# EAGLE design uDC_module (EAGLE 7.2.0)
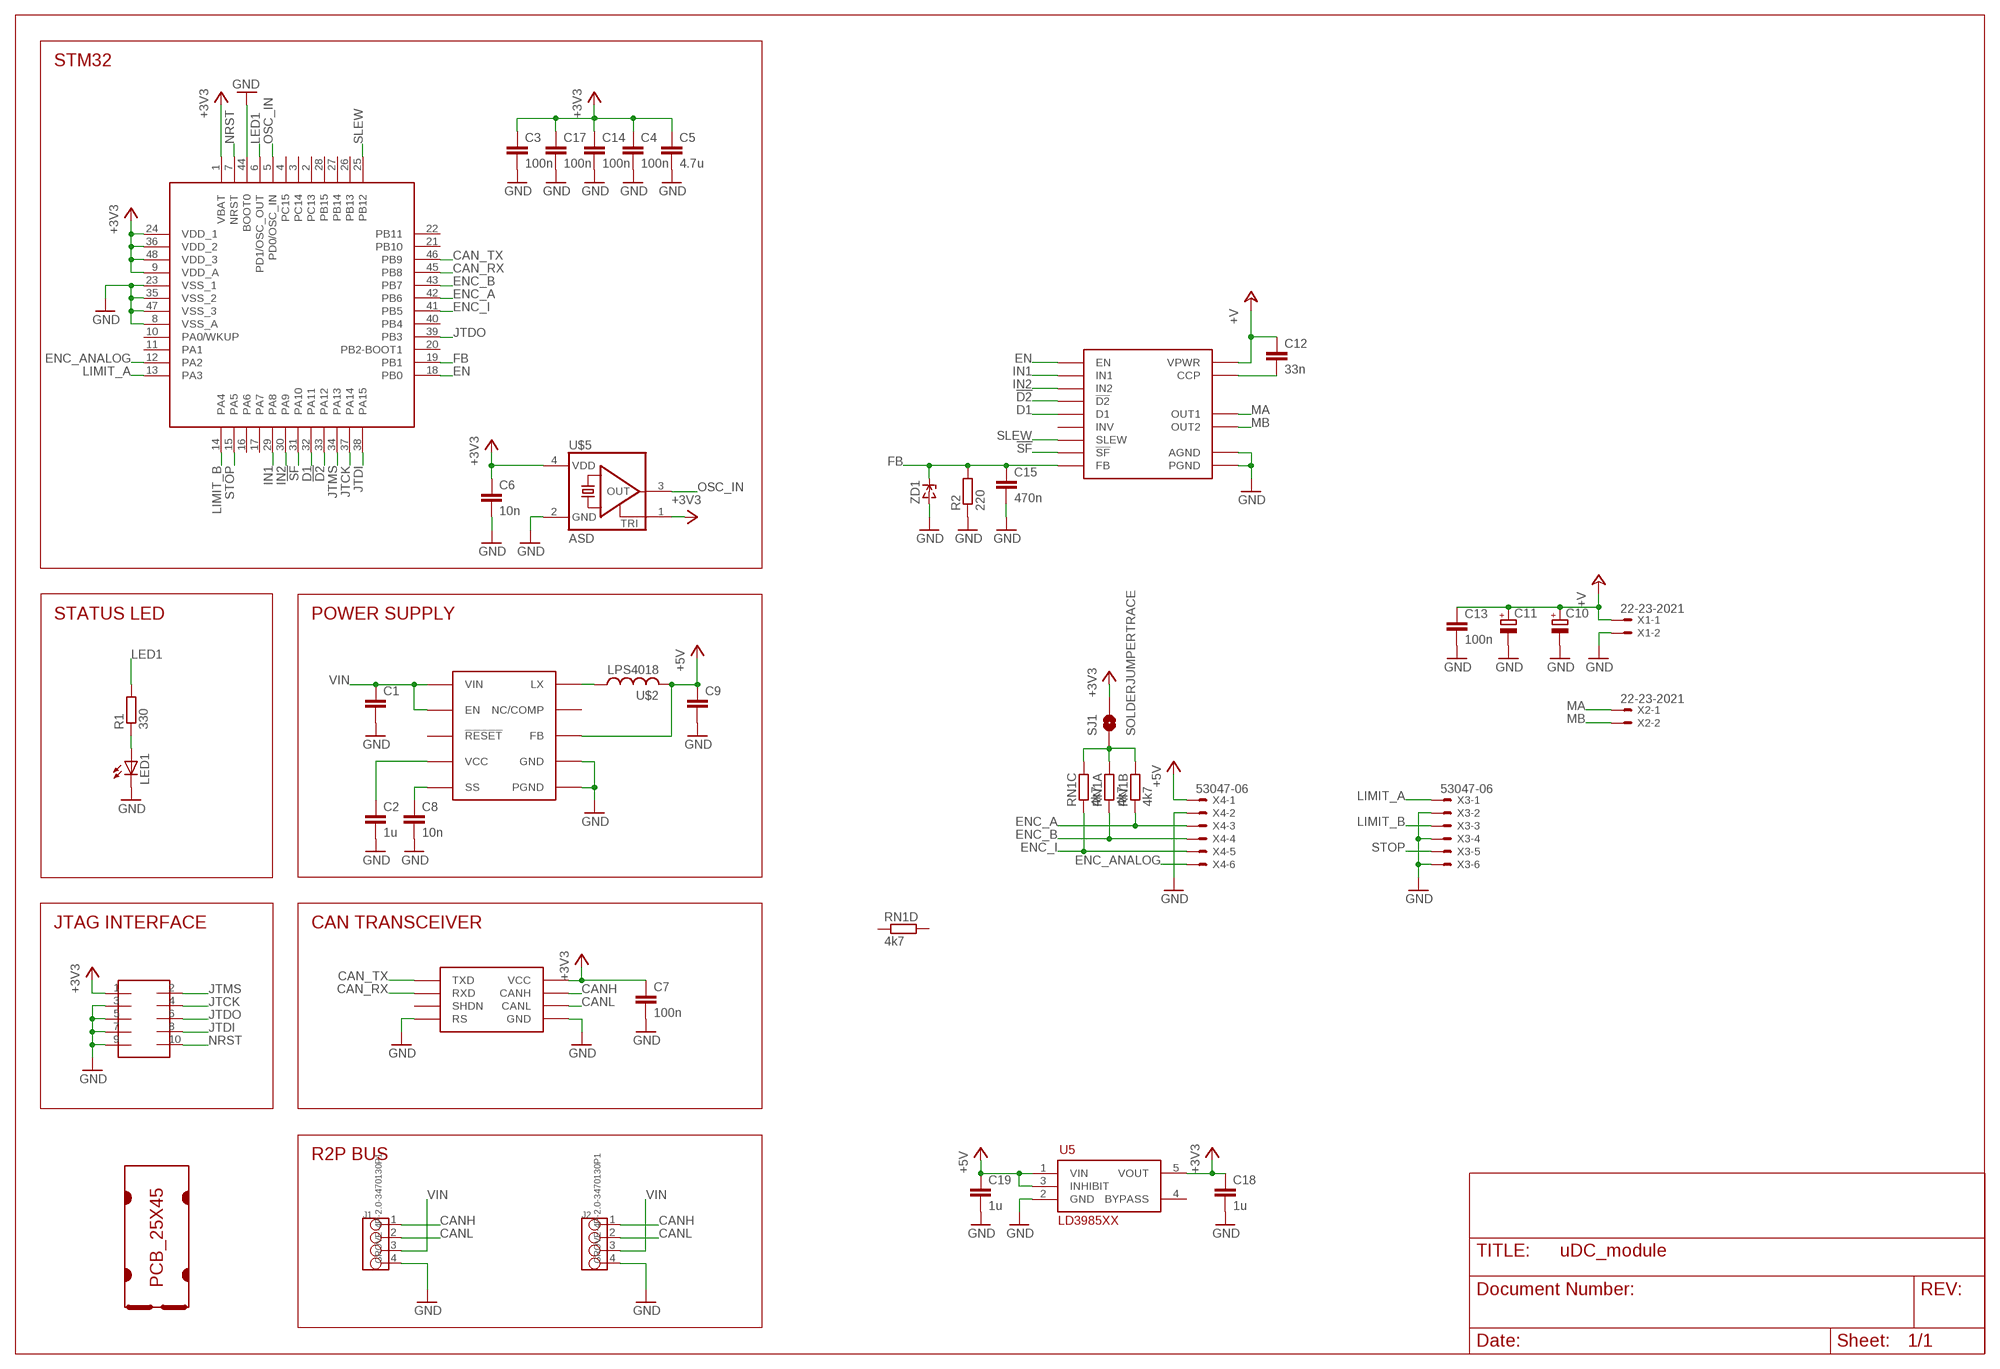
[diagram p0: schematic, sheet 1]

## Parts
C1  C-EUC1206  [C1206]
C2  1u  C-EUC0603  [C0603]
C3  100n  C-EUC0603  [C0603]
C4  100n  C-EUC0603  [C0603]
C5  4.7u  C-EUC0805  [C0805]
C6  10n  C-EUC0603  [C0603]
C7  100n  C-EUC0603  [C0603]
C8  10n  C-EUC0603  [C0603]
C9  C-EUC0805  [C0805]
C10  CPOL-EUD  [PANASONIC_D]
C11  CPOL-EUD  [PANASONIC_D]
C12  33n  C-EUC0603  [C0603]
C13  100n  C-EUC0603  [C0603]
C14  100n  C-EUC0603  [C0603]
C15  470n  C-EUC0603  [C0603]
C17  100n  C-EUC0603  [C0603]
C18  1u  C-EUC0603  [C0603]
C19  1u  C-EUC0603  [C0603]
J1  GROVE-4P-2.0-3470130P1  [4P-2.0]
J2  GROVE-4P-2.0-3470130P1  [4P-2.0]
LED1  LEDCHIPLED_0805  [CHIPLED_0805]
R1  330  R-EU_R0603  [R0603]
R2  220  R-EU_R0603  [R0603]
RN1  4k7  RESISTOR_ARRAY_4  [RN8P-4R-CRA06S]
SJ1  SOLDERJUMPERTRACE  [SJ_2S-TRACE]
SOT1  MAX3051EKA  [SOT23-8L]
U5  LD3985XX  [SOT23-5L]
U$1  PCB_25X45  [25X45]
U$2  LPS4018  [LPS4018]
U$3  MAX17501  [TDFN-10]
U$4  FTSH-105TH  [FTSH-105-TH]
U$5  ASD  [2.5X2]
U$6  STM32F103CXTX  [LQFP48]
U$7  MC33962  [PQFN32]
X1  22-23-2021  [22-23-2021]
X2  22-23-2021  [22-23-2021]
X3  53047-06  [53047-06]
X4  53047-06  [53047-06]
ZD1  ZENERSOD-323F  [SOD-323F]

## Nets
!D2: U$6.33(PA12) U$7.P$16(!D2)
!SF: U$6.31(PA10) U$7.P$21(!SF)
+3V3: C3.1 C4.1 C5.1 C6.1 C7.1 C14.1 C17.1 C18.1 SJ1.2 SOT1.3(VCC) U5.5(VOUT) U$4.1 U$5.1(TRI) U$5.4(VDD) U$6.1(VBAT) U$6.9(VDD_A) U$6.24(VDD_1) U$6.36(VDD_2) U$6.48(VDD_3)
+5V: C9.1 C19.1 U5.1(VIN) U5.3(INHIBIT) U$2.P$2 U$3.P$5(FB) X4.1
+V: C10.+ C11.+ C12.1 C13.1 U$7.P$4(VPWR) U$7.P$6(VPWR) U$7.P$11(VPWR) U$7.P$31(VPWR) X1.1
CAN_RX: SOT1.4(RXD) U$6.45(PB8)
CAN_TX: SOT1.1(TXD) U$6.46(PB9)
CANH: J1.1 J2.1 SOT1.7(CANH)
CANL: J1.2 J2.2 SOT1.6(CANL)
D1: U$6.32(PA11) U$7.P$26(D1)
EN: U$6.18(PB0) U$7.P$10(EN)
ENC_A: RN1.2 U$6.42(PB6) X4.3
ENC_ANALOG: U$6.12(PA2) X4.6
ENC_B: RN1.1 U$6.43(PB7) X4.4
ENC_I: RN1.3 U$6.41(PB5) X4.5
FB: C15.1 R2.2 U$6.19(PB1) U$7.P$8(FB) ZD1.C
GND: C1.2 C2.2 C3.2 C4.2 C5.2 C6.2 C7.2 C8.2 C9.2 C10.- C11.- C13.2 C14.2 C15.2 C17.2 C18.2 C19.2 J1.4 J2.4 LED1.C R2.1 SOT1.2(GND) SOT1.8(RS) U5.2(GND) U$3.P$1(PGND) U$3.P$9(GND) U$3.P$11(PGND) U$4.3 U$4.5 U$4.7 U$4.9 U$5.2(GND) U$6.8(VSS_A) U$6.23(VSS_1) U$6.35(VSS_2) U$6.44(BOOT0) U$6.47(VSS_3) U$7.P$5(AGND) U$7.P$18(PGND) U$7.P$19(PGND) U$7.P$20(PGND) U$7.P$22(PGND) U$7.P$23(PGND) U$7.P$24(PGND) U$7.P$33(AGND) X1.2 X3.2 X3.4 X3.6 X4.2 ZD1.A
IN1: U$6.29(PA8) U$7.P$2(IN1)
IN2: U$6.30(PA9) U$7.P$1(IN2)
JTCK: U$4.4 U$6.37(PA14)
JTDI: U$4.8 U$6.38(PA15)
JTDO: U$4.6 U$6.39(PB3)
JTMS: U$4.2 U$6.34(PA13)
LED1: R1.2 U$6.6(PD1/OSC_OUT)
LIMIT_A: U$6.13(PA3) X3.1
LIMIT_B: U$6.14(PA4) X3.3
MA: U$7.P$12(OUT1) U$7.P$13(OUT1) U$7.P$14(OUT1) U$7.P$15(OUT1) X2.1
MB: U$7.P$27(OUT2) U$7.P$28(OUT2) U$7.P$29(OUT2) U$7.P$30(OUT2) X2.2
N$1: U$2.P$1 U$3.P$10(LX)
N$4: LED1.A R1.1
N$5: RN1.6 RN1.7 RN1.8 SJ1.1
N$6: C12.2 U$7.P$32(CCP)
N$7: C2.1 U$3.P$4(VCC)
N$8: C8.1 U$3.P$6(SS)
NRST: U$4.10 U$6.7(NRST)
OSC_IN: U$5.3(OUT) U$6.5(PD0/OSC_IN)
SLEW: U$6.25(PB12) U$7.P$3(SLEW)
STOP: U$6.15(PA5) X3.5
VIN: C1.1 J1.3 J2.3 U$3.P$2(VIN) U$3.P$3(EN)
Unconnected: RN1.4 RN1.5 SOT1.5(SHDN) U5.4(BYPASS) U$3.P$7(NC/COMP) U$3.P$8(!RESET) U$6.2(PC13) U$6.3(PC14) U$6.4(PC15) U$6.10(PA0/WKUP) U$6.11(PA1) U$6.16(PA6) U$6.17(PA7) U$6.20(PB2-BOOT1) U$6.21(PB10) U$6.22(PB11) U$6.26(PB13) U$6.27(PB14) U$6.28(PB15) U$6.40(PB4) U$7.P$7(INV)

## Notes on the sheet
- STM32
- STATUS LED | POWER SUPPLY
- JTAG INTERFACE | CAN TRANSCEIVER
- R2P BUS

## Library data of the parts
C1-C9 C12-C15 C17-C19 = rcl:C-EU: CAPACITOR, European symbol
C10 C11 = rcl:CPOL-EU: POLARIZED CAPACITOR, European symbol
J1 J2 = OPL Eagle Library:GROVE-4P-2.0
LED1 = led:LED: LED OSRAM: - CHIPLED LG R971, LG N971, LY N971, LG Q971, LY Q971, LO R971, LY R971 LH N974, LH R974 LS Q976, LO Q976, LY Q976 LO Q996 - Hyper CHIPLED LW Q18S LB Q993, LB Q99A, LB R99A - SideLED LS A670, LO A670, LY A670, LG A670, LP A670 LB A673, LV A673, LT A673, LW A673 LH A674 LY A675 LS A676, LA A676, LO A676, LY A676, LW A676 LS A679, LY A679, LG A679 - Hyper Micro SIDELED® LS Y876, LA Y876, LO Y876, LY Y876 LT Y87S - SmartLED LW L88C, LW L88S LB L89C, LB L89S, LG L890 LS L89K, LO L89K, LY L89K LS L896, LA L896, LO L896, LY L896 - TOPLED LS T670, LO T670, LY T670, LG T670, LP T670 LSG T670, LSP T670, LSY T670, LOP T670, LYG T670 LG T671, LOG T671, LSG T671 LB T673, LV T673, LT T673, LW T673 LH T674 LS T676, LA T676, LO T676, LY T676, LB T676, LH T676, LSB T676, LW T676 LB T67C, LV T67C, LT T67C, LS T67K, LO T67K, LY T67K, LW E67C LS E67B, LA E67B, LO E67B, LY E67B, LB E67C, LV E67C, LT E67C LW T67C LS T679, LY T679, LG T679 LS T770, LO T770, LY T770, LG T770, LP T770 LB T773, LV T773, LT T773, LW T773 LH T774 LS E675, LA E675, LY E675, LS T675 LS T776, LA T776, LO T776, LY T776, LB T776 LHGB T686 LT T68C, LB T68C - Hyper Mini TOPLED® LB M676 - Mini TOPLED Santana® LG M470 LS M47K, LO M47K, LY M47K Source: http://www.osram.convergy.de LUXEON: - LUMILED® LXK2-PW12-R00, LXK2-PW12-S00, LXK2-PW14-U00, LXK2-PW14-V00 LXK2-PM12-R00, LXK2-PM12-S00, LXK2-PM14-U00 LXK2-PE12-Q00, LXK2-PE12-R00, LXK2-PE12-S00, LXK2-PE14-T00, LXK2-PE14-U00 LXK2-PB12-K00, LXK2-PB12-L00, LXK2-PB12-M00, LXK2-PB14-N00, LXK2-PB14-P00, LXK2-PB14-Q00 LXK2-PR12-L00, LXK2-PR12-M00, LXK2-PR14-Q00, LXK2-PR14-R00 LXK2-PD12-Q00, LXK2-PD12-R00, LXK2-PD12-S00 LXK2-PH12-R00, LXK2-PH12-S00 LXK2-PL12-P00, LXK2-PL12-Q00, LXK2-PL12-R00 Source: www.luxeon.com KINGBRIGHT: KA-3528ASYC Source: www.kingbright.com
R1 R2 = rcl:R-EU_: RESISTOR, European symbol
RN1 = dp_devices:RESISTOR_ARRAY_4: 4 Resistor Array 0603
SJ1 = SparkFun:SOLDERJUMPER: Solder Jumper Standard SMD solder jumper. Used to automate production. Two varients : Normally Open and Normally Closed are the same, but have different paste layers. NC will have a large amount of paste and should jumper during reflow.
SOT1 = maxim:MAX3051
U5 = st:LD3985XX
U$1 = r2p_pcb:PCB_25X45
U$2 = coilcraft:LPS4018
U$3 = maxim:MAX17501
U$4 = samtec:FTSH-105
U$5 = abracon:ASD
U$6 = st:STM32F103CX
U$7 = freescale:MC33962
X1 X2 = con-molex:22-23-2021: .100" (2.54mm) Center Header - 2 Pin; MF: MOLEX; MPN: 22-23-2021; OC_FARNELL: 1462926; OC_NEWARK: 25C3832
X3 X4 = con-molex:53?-06: CONNECTOR wire to board 1.25 mm (.049 inch) pitch header; MPN: 53047-0610-C; OC_FARNELL: 9733078; OC_NEWARK: 03M2965
ZD1 = dp_devices:ZENER: Zener Diode SOD-323

## Board
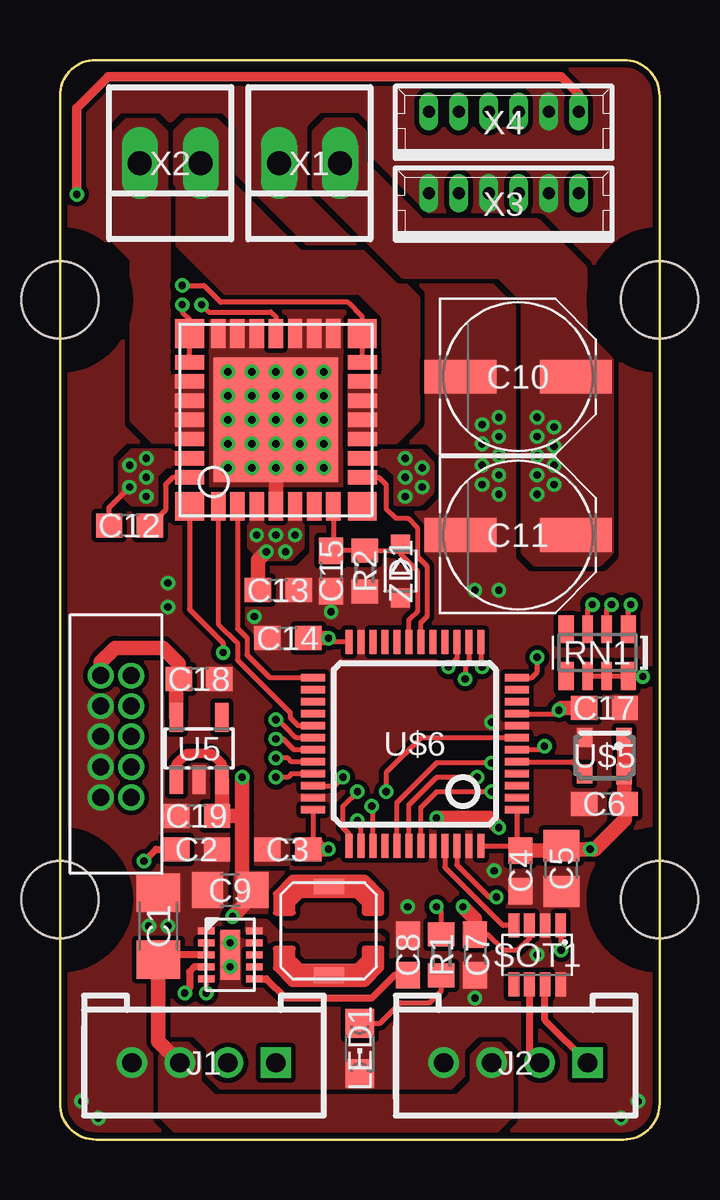
[diagram p1: board, top side]
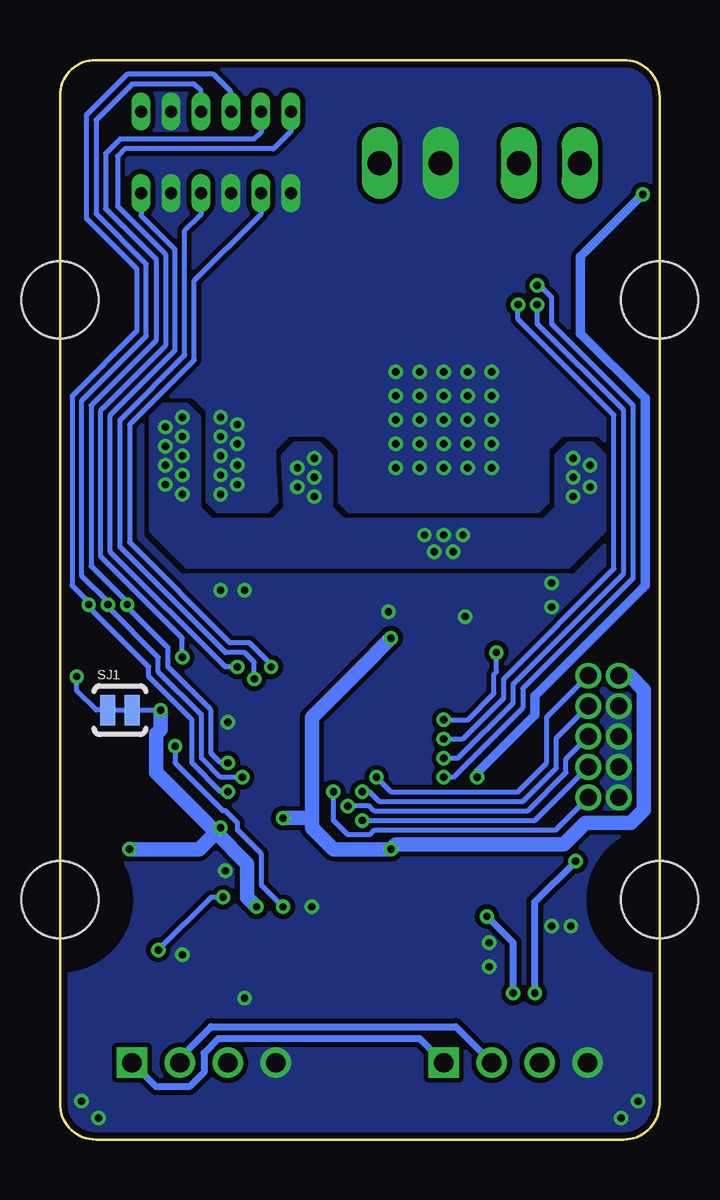
[diagram p2: board, bottom side, seen from below]

Size 25 x 45 mm. Coordinates in mm from the lower left corner, seen from the top.
Copper layers (1*16): Top 0.035mm / dielectric 1.5mm / Bottom 0.035mm
Design rules "test": minimum track width 0.2mm, minimum drill 0.3mm, track to track 0.2mm, track to pad 0.2mm, pad to pad 0.2mm, via to via 0.2mm, smd to smd 0mil, copper to edge 10mil, drill to drill 10mil, minimum pad ring 0.15mm, minimum via ring 0.15mm, stop-mask expansion 2mil, vias tented up to drill 100mil, thermal gap 10mil
tRestrict: 2 lines

### Footprints (pad centres in the part's own frame; a part is rotated, then mirrored left to right if it is on the bottom)
C1206 = smd 1.6 x 1.8: 1 -1.4,0; 2 1.4,0
C0603 = smd 1.1 x 1: 1 -0.85,0; 2 0.85,0
C0805 = smd 1.3 x 1.5: 1 -0.95,0; 2 0.95,0
PANASONIC_D = smd 3 x 1.4: + 2.4,0; - -2.4,0
4P-2.0 = drill 0.8 pad 1.27 square: 1 -3,0 | drill 0.8 pad 1.27: 2 -1,0; 3 1,0; 4 3,0
CHIPLED_0805 = smd 1.2 x 1.2: A 0,-1.05; C 0,1.05
R0603 = smd 1 x 1.1: 1 -0.85,0; 2 0.85,0
RN8P-4R-CRA06S = smd 0.63 x 1.15: 1 -1.295,-0.975; 4 1.295,-0.975; 5 1.295,0.975; 8 -1.295,0.975 | smd 0.44 x 1.15: 2 -0.4,-0.975; 3 0.4,-0.975; 6 0.4,0.975; 7 -0.4,0.975
SJ_2S-TRACE = smd 0.635 x 1.27: 1 -0.508,0; 2 0.508,0
SOT23-8L = smd 0.45 x 1: 1 -0.975,-1.225; 2 -0.325,-1.225; 3 0.325,-1.225; 4 0.975,-1.225; 5 0.975,1.225; 6 0.325,1.225; 7 -0.325,1.225; 8 -0.975,1.225
SOT23-5L = smd 0.55 x 1.2: 1 -0.95,-1.3; 2 0,-1.3; 3 0.95,-1.3; 4 0.95,1.3; 5 -0.95,1.3
25X45 = hole 3.2: 0,10; 25,10; 0,35; 25,35
LPS4018 = smd 0.635 x 1.27: P$1 -1.85,0; P$2 1.85,0
TDFN-10 = smd 0.7 x 0.3: P$1 -1,1; P$2 -1,0.5; P$3 -1,0; P$4 -1,-0.5; P$5 -1,-1; P$6 1,-1; P$7 1,-0.5; P$8 1,0; P$9 1,0.5; P$10 1,1 | smd 0.8 x 2.08: P$11 0,0
FTSH-105-TH = drill 0.711 pad 1.016: 1 -2.54,0; 2 -2.54,1.27; 3 -1.27,0; 4 -1.27,1.27; 5 0,0; 6 0,1.27; 7 1.27,0; 8 1.27,1.27; 9 2.54,0; 10 2.54,1.27
2.5X2 = smd 0.65 x 0.8: 1 -0.825,-0.762; 2 0.825,-0.762; 3 0.825,0.762 | smd 0.65 x 0.85: 4 -0.825,0.762
LQFP48 = smd 1 x 0.3: 1 -4.25,2.75; 2 -4.25,2.25; 3 -4.25,1.75; 4 -4.25,1.25; 5 -4.25,0.75; 6 -4.25,0.25; 7 -4.25,-0.25; 8 -4.25,-0.75; 9 -4.25,-1.25; 10 -4.25,-1.75; 11 -4.25,-2.25; 12 -4.25,-2.75; 25 4.25,-2.75; 26 4.25,-2.25; 27 4.25,-1.75; 28 4.25,-1.25; 29 4.25,-0.75; 30 4.25,-0.25; 31 4.25,0.25; 32 4.25,0.75; 33 4.25,1.25; 34 4.25,1.75; 35 4.25,2.25; 36 4.25,2.75 | smd 0.3 x 1: 13 -2.75,-4.25; 14 -2.25,-4.25; 15 -1.75,-4.25; 16 -1.25,-4.25; 17 -0.75,-4.25; 18 -0.25,-4.25; 19 0.25,-4.25; 20 0.75,-4.25; 21 1.25,-4.25; 22 1.75,-4.25; 23 2.25,-4.25; 24 2.75,-4.25; 37 2.75,4.25; 38 2.25,4.25; 39 1.75,4.25; 40 1.25,4.25; 41 0.75,4.25; 42 0.25,4.25; 43 -0.25,4.25; 44 -0.75,4.25; 45 -1.25,4.25; 46 -1.75,4.25; 47 -2.25,4.25; 48 -2.75,4.25
PQFN32 = smd 1.2 x 1.2: P$1 -3.6,3.6; P$9 -3.6,-3.6; P$17 3.6,-3.6; P$25 3.6,3.6 | smd 1.2 x 0.6: P$2 -3.6,2.4; P$3 -3.6,1.6; P$4 -3.6,0.8; P$5 -3.6,0; P$6 -3.6,-0.8; P$7 -3.6,-1.6; P$8 -3.6,-2.4; P$18 3.6,-2.4; P$19 3.6,-1.6; P$20 3.6,-0.8; P$21 3.6,0; P$22 3.6,0.8; P$23 3.6,1.6; P$24 3.6,2.4 | smd 0.6 x 1.2: P$10 -2.4,-3.61; P$11 -1.6,-3.61; P$12 -0.8,-3.61; P$13 0,-3.61; P$14 0.8,-3.61; P$15 1.6,-3.61; P$16 2.4,-3.61; P$26 2.4,3.6; P$27 1.6,3.6; P$28 0.8,3.6; P$29 0,3.6; P$30 -0.8,3.6; P$31 -1.6,3.6; P$32 -2.4,3.6 | smd 5.2 x 5.2: P$33 0,0
22-23-2021 = drill 1 long: 1 -1.27,0; 2 1.27,0
53047-06 = drill 0.5 pad 0.698 long: 1 3.125,0.45; 2 1.875,0.45; 3 0.625,0.45; 4 -0.625,0.45; 5 -1.875,0.45; 6 -3.125,0.45
SOD-323F = smd 0.8 x 0.8: A 1.125,0; C -1.125,0

### Placement (x,y rotation side)
C1  4.1,8.9 90 top
C2  5.7,12.1 0 top
C3  9.5,12.1 180 top
C4  19.2,11.2 270 top
C5  20.9,11.3 270 top
C6  22.7,14 180 top
C7  17.3,7.7 270 top
C8  14.5,7.7 90 top
C9  7.1,10.4 180 top
C10  19.1,31.8 0 top
C11  19.1,25.2 0 top
C12  2.9,25.6 0 top
C13  9.1,22.9 0 top
C14  9.5,20.9 180 top
C15  11.3,23.7 270 top
C17  22.7,18 0 top
C18  5.8,19.2 0 top
C19  5.7,13.5 180 top
J1  6,3.2 180 top
J2  19,3.2 180 top
LED1  12.5,3.8 180 top
R1  15.9,7.7 90 top
R2  12.7,23.7 90 top
RN1  22.4,20.3 180 top
SJ1  22.5,17.9 0 bottom
SOT1  19.9,7.7 180 top
U5  5.8,16.3 0 top
U$1  0,0 0 top
U$2  11.2,8.7 90 top
U$3  7.1,7.7 0 top
U$4  1.7,16.8 270 top
U$5  22.7,16 180 top
U$6  14.8,16.5 180 top
U$7  9,30 90 top
X1  10.4,40.7 180 top
X2  4.6,40.7 180 top
X3  18.5,39 0 top
X4  18.5,42.4 0 top
ZD1  14.2,23.7 270 top

### Tracks (layer width: path | path; a pad name or v marks a point on that pad's centre or on a via)
!D2  (via drill 0.3)
  Top 0.2: U$7.P$16 12.6,34.3 12,34.9 6.7,34.9 6,35.6 v5.1,35.6 | U$6.33 9.65,15.25 9.5,15.1 v9,15.1
  Bottom 0.2: v5.1,35.6 5,35.6 4.5,35.1 4.5,34 1.1,30.6 1.1,23.4 5.7,18.8 5.7,18 8.2,15.5 8.6,15.1 v9,15.1
!SF  (via drill 0.3)
  Top 0.2: v5.9,34.8 6.2,34.5 8.8,34.5 9,34.3 U$7.P$21 | U$6.31 9.75,16.25 9.3,16.7 v9,16.7
  Bottom 0.2: v5.9,34.8 5.9,34.2 1.9,30.2 1.9,23.8 6.5,19.2 6.5,18.4 8.2,16.7 v9,16.7
+3V3  (via drill 0.3)
  Top 0.2: C7.1 17.85,8.55 18.5,7.9 19.1,7.9 19.57,8.38 SOT1.3 | U$6.36 10.55,12.3 C3.1 | U$6.48 19,12.25 19.05,12.2 | 19.05,12.2 C4.1 19.05,12.2 | U$6.1 19.05,12.2 | U$6.24 11.35,20.75 v11.2,20.9 | U$6.9 20.65,17.75 v20.8,17.9 | C17.1 22,18
  Top 0.6: 10.55,12.3 10.7,12.3 | C7.1 17.3,9.2 v16.8,9.7 | C3.1 v11.2,12.1 | U$4.1 1.7,19.9 2.3,20.5 4.3,20.5 4.95,19.85 C18.1 4.85,19.1 U5.5 | v15.7,13.4 17.9,13.4 v18.3,13 | C14.1 v11.2,20.9 | U$5.1 U$5.4 23.52,14.03 C6.1 23.55,13.35 22.7,12.5 22.3,12.1 v22.1,12.1 21.05,12.1 C5.1 | 20.7,12.05 C5.1 | 19.05,12.05 19,12 19.05,12.05 | C4.1 20.7,12.05 | 20.7,12.05 C5.1 | 19.05,12.2 19.05,12.05 | C17.1 20.9,18 v20.8,17.9
  Bottom 0.2: SJ1.2 v20.8,17.9
  Bottom 0.6: U$4.1 1.24,19.34 0.65,18.75 0.65,13.75 1.2,13.2 3.1,13.2 4,12.3 11,12.3 v11.2,12.1 13.6,12.1 14.5,13 14.5,13.5 | 14.5,13.5 14.5,17.6 12.5,19.6 v11.2,20.9 | v15.7,13.4 14.6,13.4 14.5,13.5 | v16.8,9.7 17.2,10.1 17.2,11.5 18.5,12.8 | v20.8,17.9 20.8,17.1 21,16.9 21,15.5 21,15.3 18.5,12.8 | v18.3,13 18.5,12.8 | 18.5,12.8 19.2,12.1 v22.1,12.1
+5V  (via drill 0.3)
  Top 0.2: U$3.P$5 v6.1,6.1
  Top 0.4: U5.1 4.85,15.65 5.3,16.1 6.3,16.1 6.75,15.65 U5.3 | v0.7,39.4 0.7,43 2,44.3 20.9,44.3 21.62,43.58 X4.1
  Top 0.5: 6.75,13.7 C19.1
  Top 0.6: v7.2,9.3 8.05,10.15 C9.1 7.6,10.85 7.6,13.5 | U5.3 6.75,13.7 | 7.6,13.5 v7.6,15.1 | C19.1 7.6,13.5
  Bottom 0.3: v6.1,6.1 6.1,8.2 v7.2,9.3
  Bottom 0.4: v0.7,39.4 3.3,36.8 3.3,33.6 0.6,30.9 0.6,23.1 0.7,23 5.2,18.5 5.2,17.7 7.6,15.3 v7.6,15.1
  pour Top (rank 5, no thermals): 13.3,8.9 13.5,9.1 13.5,10.3 12.8,11 9.5,11 9.4,11.1 7.5,11.1 7.3,10.9 7.3,9.8 8.3,8.9
+V  (via drill 0.3)
  Top 0.2: C12.1 2.05,26.35 v2.9,27.2
  Top 0.6: C13.1 8.25,24.15 v8.6,24.5
  other vias: 3.6,28.4 8.2,25.2 3.6,27.6 3.6,26.8 2.9,28.1 9.4,24.5 9.8,25.2 9,25.2 19.9,30.1 14.4,28.4 14.4,27.6 14.4,26.8 15.1,27.2 15.1,28 19.9,29.3 19.9,28.5 19.9,27.7 19.9,26.9 20.6,27.3 20.6,28.1 20.6,28.9 20.6,29.7
  pour Bottom: 2.3,28.5 2.8,29 3.8,29 4.3,28.5 4.3,26.3 4.8,25.8 13.2,25.8 13.7,26.3 13.7,28.5 14.2,29 15.2,29 15.7,28.5 15.6,26.3 16.1,25.8 18.7,25.8 19.2,26.3 19.2,30.1 19.7,30.6 20.7,30.6 21.2,30.1 21.2,25.4 19.7,23.9 3.8,23.9 2.3,25.4
  pour Top (rank 2, no thermals): 22.5,24 23,24.5 23,32.5 21.9,33.6 21.9,36.3 19.9,38.3 15.1,38.3 12.7,40.7 12.7,42 12.2,42.5 11.1,42.5 10.6,42 10.6,39.7 14.3,36 18.3,36 19.3,35 19.3,24.5 19.8,24
  pour Top (no thermals): 5.9,28.7 3,28.7 2.5,28.2 2.5,27 3,26.5 4,26.5 4,27.7 4.4,28.1 5.9,28.1
  pour Top (no thermals): 12.1,28.7 15,28.7 15.5,28.2 15.5,27 15,26.5 14,26.5 14,27.7 13.6,28.1 12.2,28.1
  pour Top (no thermals): 7.9,26.9 10.1,26.9 10.1,24.7 9.6,24.2 8.4,24.2 7.9,24.7
CAN_RX
  Top 0.2: U$6.45 16.05,11.35 18.4,9 18.48,8.93 SOT1.4
CAN_TX  (via drill 0.3)
  Top 0.2: U$6.46 16.55,11.45 17.9,10.1 v18.2,10.1 | SOT1.1 20.88,7.92 v20.9,7.9
  Bottom 0.2: v18.2,10.1 18.7,10.1 v20.9,7.9
CANH
  Top 0.3: J2.1 20.23,4.97 SOT1.7
  Bottom 0.3: J1.1 10,4.2 18.4,4.2 19,3.6 19,2.8 19.6,2.2 21,2.2 J2.1
CANL
  Top 0.3: 19.57,3.62 J2.2 19.57,3.62 | SOT1.6 19.57,3.62
  Bottom 0.3: J1.2 8.5,4.7 18.7,4.7 20,3.4 J2.2
D1  (via drill 0.3)
  Top 0.2: U$7.P$26 5.4,34.2 5.1,34.5 v5.1,34.8 | U$6.32 9.65,15.75 9.5,15.9 v9,15.9
  Bottom 0.2: v5.1,34.8 5.1,34 1.5,30.4 1.5,23.6 6.1,19 6.1,18.2 8.4,15.9 v9,15.9
EN
  Top 0.2: U$7.P$10 13.3,27.6 13.6,27.3 13.6,26.3 14,25.9 14.5,25.9 14.9,25.5 14.9,24.3 15.3,23.9 15.3,21.8 15.1,21.6 15.05,21.55 U$6.18
ENC_A  (via drill 0.3)
  Top 0.2: v17.4,15.1 15.7,15.1 14.55,13.95 U$6.42 | RN1.2 22.8,22.1 v23,22.3
  Bottom 0.2: X4.3 19.12,43.73 19.4,44 22,44 23.5,42.5 23.5,38.6 21.4,36.5 21.4,33.5 24.1,30.8 24.1,23.5 23,22.4 v23,22.3 23,22.2 20.9,20.1 20.9,19.5 19.1,17.7 19.1,15.9 18.3,15.1 v17.4,15.1
ENC_ANALOG  (via drill 0.3)
  Top 0.2: U$6.12 19.65,19.25 19.9,19.5 v19.9,20.1
  Bottom 0.2: X4.6 15.38,42.02 16.1,41.3 22.3,41.3 22.6,41 22.6,38.9 20.6,36.9 20.6,33.1 23.1,30.6 | 23.1,30.6 23.3,30.4 | v19.9,20.1 19.9,20.9 23.3,24.3 23.3,30.4 | 23.3,30.4 23.1,30.6
ENC_B  (via drill 0.3)
  Top 0.2: v18,14.5 15.7,14.5 15.05,13.85 U$6.43 | RN1.1 23.7,22.2 v23.8,22.3
  Bottom 0.2: X4.4 17.88,43.67 18.6,44.4 22.2,44.4 23.9,42.7 23.9,38.4 21.8,36.3 21.8,33.7 24.5,31 24.5,23.1 23.8,22.4 v23.8,22.3 | v18,14.5 18.3,14.5 19.5,15.7 19.5,17.5 21.3,19.3 21.3,19.7 23.8,22.2 | 23.8,22.2 v23.8,22.3 | 23.8,22.2 v23.8,22.3
ENC_I  (via drill 0.3)
  Top 0.2: v18,15.7 15.7,15.7 14.05,14.05 U$6.41 | RN1.3 22,22.1 v22.2,22.3
  Bottom 0.2: X4.5 16.62,41.98 16.9,41.7 22.5,41.7 23.1,41.1 23.1,38.8 21,36.7 21,33.3 23.7,30.6 23.7,23.9 22.2,22.4 v22.2,22.3 22.2,22.2 20.5,20.5 20.5,19.7 18.7,17.9 18.7,16.1 18.3,15.7 v18,15.7
FB
  Top 0.2: U$7.P$8 11.4,24.65 C15.1 R2.2 13.93,24.55 ZD1.C 14.2,24.4 14.9,23.7 14.9,22 14.6,21.7 14.55,21.65 U$6.19
GND  (via drill 0.3)
  Top 0.6: U$7.P$5 v9,28
  other vias: 7.1,8.2 7.1,7.2 4.5,8.9 3.7,8.9 17.3,5.9 19.9,7.7 24.1,1.6 23.4,0.9 1.6,0.9 0.9,1.6 18,17.4 18.3,26.9 18.3,30.1 18.3,29.3 18.3,28.5 18.3,27.7 17.6,28.1 17.6,29 17.6,29.8 17.6,27.3 11,28 7,28 7,32 11,32 11,30 7,30 9,32 9,30 10,31 8,31 8,29 10,29 10,32 8,32 7,31 7,29 8,28 8,30 9,31 10,30 11,31 11,29 10,28 9,29 4.5,23.2 4.5,22.2 8.1,21.8 11.3,22 18.3,22.9 17.3,22.9 18.1,11.2 14.5,9.7
  pour Bottom (rank 6, no thermals): 0,0 25,0 25,45 0,45
  pour Top (rank 6, no thermals): 0,0 25,0 25,45 0,45
IN1
  Top 0.2: U$7.P$2 6.6,21.5 7.4,20.7 7.4,20 9.6,17.8 9.6,17.6 9.95,17.25 U$6.29
IN2  (via drill 0.3)
  Top 0.2: U$7.P$1 5.4,22.1 6.8,20.7 v6.8,20.3 | U$6.30 9.85,16.75 9.4,17.2 9.1,17.5 v9,17.5
  Bottom 0.2: v9,17.5 8,17.5 6.9,18.6 6.9,19.4 6.8,19.5 v6.8,20.3
JTCK  (via drill 0.3)
  Top 0.2: U$6.37 12.05,12.75 11.8,13 11.8,13.9 v12.4,14.5
  Bottom 0.2: v12.4,14.5 12.1,14.5 11.7,14.1 5.7,14.1 4.3,15.5 4.3,16.74 U$4.4
JTDI  (via drill 0.3)
  Top 0.2: U$6.38 12.55,13.15 v12.4,13.3
  Bottom 0.2: v12.4,13.3 5.2,13.3 U$4.8
JTDO  (via drill 0.3)
  Top 0.2: U$6.39 13.05,13.85 v13,13.9
  Bottom 0.2: v13,13.9 12.1,13.9 11.9,13.7 5.5,13.7 3.9,15.3 3.9,15.87 U$4.6
JTMS  (via drill 0.3)
  Top 0.2: U$6.34 11.45,14.75 v11.8,15.1
  Bottom 0.2: v11.8,15.1 11.2,14.5 5.9,14.5 4.7,15.7 4.7,17.61 U$4.2
LED1  (via drill 0.3)
  Top 0.2: v20.2,16.4 20.05,16.25 U$6.6 | R1.2 15.9,9.5 v15.7,9.7
  Bottom 0.2: v20.2,16.4 20.2,15.7 18.4,13.9 18.2,13.7 18.1,13.7 17.6,13.2 17.6,12.9 16.6,11.9 16.6,10.6 v15.7,9.7
LIMIT_A  (via drill 0.3)
  Top 0.2: U$6.13 17.55,19.75 v17.6,19.7
  Bottom 0.2: v17.6,19.7 18.1,19.7 22.9,24.5 22.9,30.2 20.2,32.9 20.2,37.1 21.6,38.5 21.62,38.52 X3.1
LIMIT_B  (via drill 0.3)
  Top 0.2: U$6.14 17.05,19.95 16.9,19.8 v16.9,19.2
  Bottom 0.2: v16.9,19.2 16.9,19.9 17.3,20.3 18.1,20.3 22.5,24.7 22.5,30 19.8,32.7 19.8,37.9 19.2,38.5 19.12,38.58 X3.3
MA
  pour Top (rank 4, no thermals): 4.8,42 5.3,42.5 6.5,42.5 7,42 7,40 10,37 13,37 14.9,35.1 14.9,30 13.9,29 12.1,29 12.1,31.8 13.5,31.8 13.5,34.3 12.5,35.3 6.9,35.3 4.8,37.4
MB
  pour Top (rank 3, no thermals): 4.4,42 4.4,39.6 4.5,39.5 4.5,31.8 5.9,31.8 5.9,29 4,29 3,30 3,36.7 2.3,37.4 2.3,42 2.8,42.5 3.9,42.5
N$1
  pour Top (no thermals): 7.8,8.7 8.2,8.7 8.5,8.2 8.5,7.5 9.6,6.4 12.8,6.4 13.5,7.1 13.5,8.3 13.3,8.5 9.2,8.5 8.6,9.1 7.8,9.1
N$4
  Top 0.2: R1.1 15.9,6.2 15.4,5.7 14.2,5.7 13.35,4.85 LED1.A
N$5  (via drill 0.3)
  Top 0.2: RN1.6 RN1.7 RN1.8 24.27,19.32 v24.3,19.3
  Bottom 0.2: SJ1.1 23.5,17.9 24.3,18.7 v24.3,19.3
N$6
  Top 0.2: U$7.P$32 4.7,27.6 4.4,27.3 4.4,26.25 C12.2
N$7  (via drill 0.3)
  Top 0.3: U$3.P$4 5.6,7.2 5.4,7 5.4,6.3 v5.2,6.1 | v3.5,11.6 4,12.1 C2.1
  Bottom 0.3: v5.2,6.1 5.2,9.9 v3.5,11.6
N$8
  Top 0.3: U$3.P$6 8.6,6.7 9.4,5.9 13,5.9 13.95,6.85 C8.1
NRST  (via drill 0.3)
  Top 0.2: U$6.7 15.05,16.75 13.6,15.3 v13.6,14.5
  Bottom 0.2: U$4.10 4.33,12.9 11.9,12.9 12.1,12.7 12.7,12.7 13,12.7 13.6,13.3 v13.6,14.5
OSC_IN
  Top 0.2: U$6.5 21.36,15.75 U$5.3
SLEW
  Top 0.2: U$7.P$3 7.4,21.3 7.8,20.9 7.8,20.2 8.75,19.25 U$6.25
STOP  (via drill 0.3)
  Top 0.2: U$6.15 16.55,20.05 v16.2,19.7
  Bottom 0.2: v16.2,19.7 16.2,19.8 17.1,20.7 17.9,20.7 22.1,24.9 22.1,29.8 19.4,32.5 19.4,35.8 16.7,38.5 16.62,38.58 X3.5
VIN
  Top 0.2: U$3.P$3 U$3.P$2
  Top 0.3: U$3.P$3 4.3,7.7 C1.1
  Top 0.6: C1.1 4.1,4.1 J1.3
  pour Top (no thermals): 4.7,4 5.3,4 5.8,3.5 5.8,2.4 6.4,1.8 16.6,1.8 17.2,2.4 17.2,3.5 17.7,4 18.3,4 18.8,3.5 18.8,1 17.8,0 5.2,0 4.2,1 4.2,3.5

### Text on the board
Document: ENC | MOTOR | SUPPLY | STOP
200bmp: uDC module / v1.1 (2014/12)